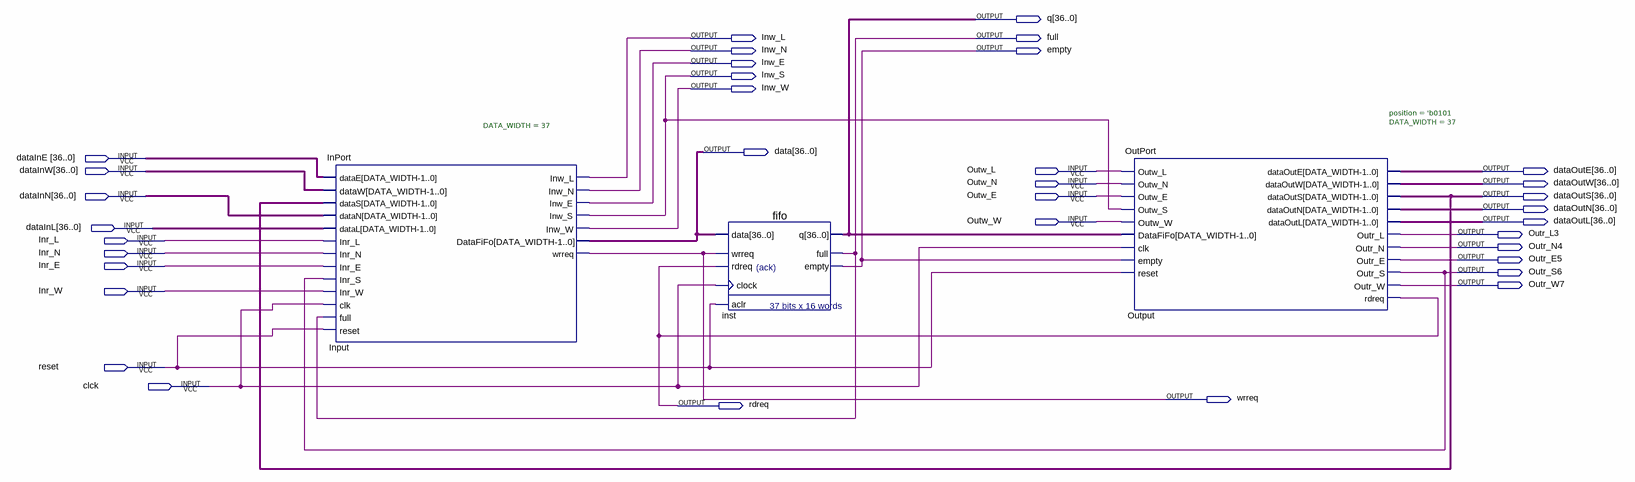
[diagram p0: schematic sheet]
// Quartus schematic NoCSimp3_m_inout.bdf as structural Verilog: 3 symbols, 35 pins
module NoCSimp3_m_inout (
  input  [36:0] dataInE,
  input  [36:0] dataInW,
  input  Outw_L,
  input  Outw_N,
  input  [36:0] dataInN,
  input  Outw_E,
  input  Outw_W,
  input  [36:0] dataInL,
  input  Inr_L,
  input  Inr_N,
  input  Inr_E,
  input  Inr_W,
  input  reset,
  input  clck,
  output [36:0] q,
  output Inw_L,
  output full,
  output Inw_N,
  output empty,
  output Inw_E,
  output Inw_S,
  output Inw_W,
  output [36:0] data,
  output [36:0] dataOutE,
  output [36:0] dataOutW,
  output [36:0] dataOutS,
  output [36:0] dataOutN,
  output [36:0] dataOutL,
  output Outr_L3,
  output Outr_N4,
  output Outr_E5,
  output Outr_S6,
  output Outr_W7,
  output wrreq,
  output rdreq
);

  InPort #(.DATA_WIDTH(37)) Input (
    .dataE(dataInE), .dataW(dataInW), .dataS(dataOutS), .dataN(dataInN), .dataL(dataInL), .Inr_L(Inr_L),
    .Inr_N(Inr_N), .Inr_E(Inr_E), .Inr_S(Outr_S6), .Inr_W(Inr_W), .clk(clck), .full(full), .reset(reset),
    .Inw_L(Inw_L), .Inw_N(Inw_N), .Inw_E(Inw_E), .Inw_S(Inw_S), .Inw_W(Inw_W), .DataFiFo(data), .wrreq(wrreq));
  fifo inst (.data(data), .wrreq(wrreq), .rdreq(rdreq), .clock(clck), .aclr(reset), .q(q), .full(full), .empty(empty));
  OutPort #(.position('b0101), .DATA_WIDTH(37)) Output (
    .Outw_L(Outw_L), .Outw_N(Outw_N), .Outw_E(Outw_E), .Outw_S(Inw_S), .Outw_W(Outw_W), .DataFiFo(q),
    .clk(clck), .empty(empty), .reset(reset), .dataOutE(dataOutE), .dataOutW(dataOutW), .dataOutS(dataOutS),
    .dataOutN(dataOutN), .dataOutL(dataOutL), .Outr_L(Outr_L3), .Outr_N(Outr_N4), .Outr_E(Outr_E5),
    .Outr_S(Outr_S6), .Outr_W(Outr_W7), .rdreq(rdreq));
endmodule
